# Altium schematic sheet Case2_Cosel.SchDoc
size A4
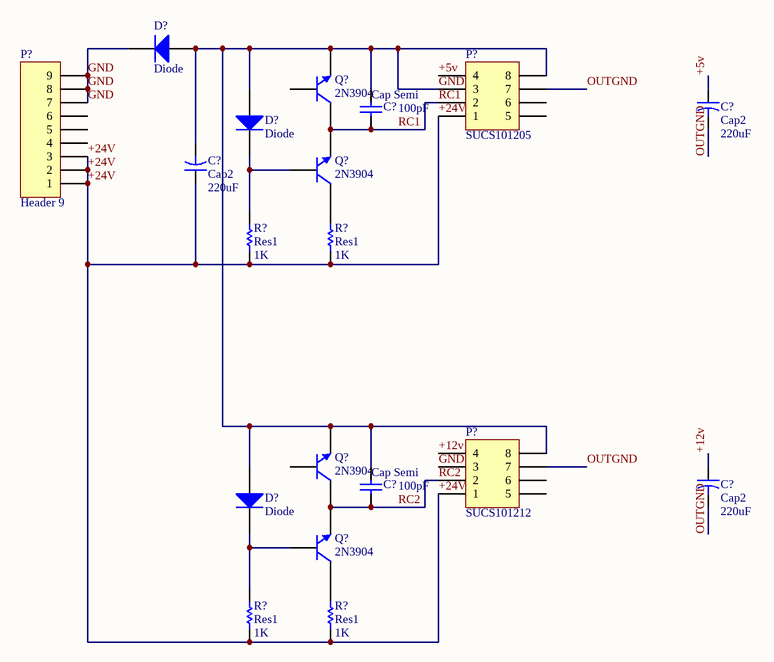
[diagram p0: Case2_Cosel.SchDoc]

## Parts
(Parts that share a designator on the sheet are numbered #1, #2 ... from top to bottom, then left to right.)
C?#1  Cap2  value 220uF  [CAPR5-4X5]
C?#2  Cap Semi  value 100pF  [C1206]
C?#3  Cap2  value 220uF  [CAPR5-4X5]
C?#4  Cap2  value 220uF  [CAPR5-4X5]
C?#5  Cap Semi  value 100pF  [C1206]
D?#1  Diode  [SMC]
D?#2  Diode  [SMC]
D?#3  Diode  [SMC]
P?#1  SUCS101205  [HDR2X4_CEN]
P?#2  Header 9  [HDR1X9]
P?#3  SUCS101212  [HDR2X4_CEN]
Q?#1  2N3904  [TO-92A]
Q?#2  2N3904  [TO-92A]
Q?#3  2N3904  [TO-92A]
Q?#4  2N3904  [TO-92A]
R?#1  Res1  value 1K  [AXIAL-0.3]
R?#2  Res1  value 1K  [AXIAL-0.3]
R?#3  Res1  value 1K  [AXIAL-0.3]
R?#4  Res1  value 1K  [AXIAL-0.3]

## Nets
+5v: C?#1.1 P?#1.4
+12v: C?#4.1 P?#3.4
+24V: C?#3.1 P?#1.1 P?#2.1 P?#2.2 P?#2.3 P?#3.1 R?#1.2 R?#2.1 R?#3.2 R?#4.1
GND: C?#2.2 C?#3.2 C?#5.2 D?#1.1(A) D?#1.2(K) D?#2.1(A) D?#3.1(A) P?#1.3 P?#1.8 P?#2.7 P?#2.8 P?#2.9 P?#3.3 P?#3.8 Q?#1.1(E) Q?#3.1(E)
OUTGND: C?#1.2 C?#4.2 P?#1.7 P?#3.7
RC1: C?#2.1 P?#1.2 Q?#1.3(C) Q?#2.1(E)
RC2: C?#5.1 P?#3.2 Q?#3.3(C) Q?#4.1(E)
NetD?#2_2: D?#2.2(K) Q?#2.2(B) R?#2.2
NetD?#3_2: D?#3.2(K) Q?#4.2(B) R?#4.2
NetQ?#2_3: Q?#2.3(C) R?#1.1
NetQ?#4_3: Q?#4.3(C) R?#3.1

Not connected (* = marked no-connect by the designer): P?#1 5 6; P?#2 4 5 6; P?#3 5 6; Q?#1 2(B); Q?#3 2(B)

## Library data of the parts
C?#1 C?#3 C?#4 = Cap2: Capacitor; Published: 23-Sep-2002; PackageReference: CAPR5-4X5; Publisher: Altium Limited
C?#2 C?#5 = Cap Semi: Capacitor (Semiconductor SIM Model); Published: 8-Jun-2000; LatestRevisionDate: 17-Jul-2002; LatestRevisionNote: Re-released for DXP Platform.; PackageReference: C1206; Publisher: Altium Limited
D?#1-D?#3 = Diode: Default Diode; Published: 8-Jun-2000; LatestRevisionDate: 17-Jul-2002; LatestRevisionNote: Re-released for DXP Platform.; PackageDocument: Sep-1996; PackageReference: SMC; Publisher: Altium Limited; Code_JEDEC: DO-214-AB
P?#1 P?#3 = Header 4X2A: Header, 4-Pin, Dual row; LatestRevisionDate: 17-Jul-2002; LatestRevisionNote: Re-released for DXP Platform.; Publisher: Altium Limited
P?#2 = Header 9: Header, 9-Pin; LatestRevisionDate: 17-Jul-2002; LatestRevisionNote: Re-released for DXP Platform.; Publisher: Altium Limited
Q?#1-Q?#4 = 2N3904: NPN General Purpose Amplifier; Published: 8-Jun-2000; LatestRevisionDate: 15-Jan-2003; LatestRevisionNote: PCB Footprint 'BCY-W3/D4.7' replaced; DatasheetDocument: 1997; PackageDocument: Sep-1998; PackageReference: TO-92A; Publisher: Altium Limited; Code_JEDEC: TO-92A; ComponentLink1Description: Manufacturer Link; ComponentLink1URL: http://www.fairchildsemi.com/; ComponentLink2Description: Datasheet; ComponentLink2URL: http://www.fairchildsemi.com/ds/2N%2F2N3904.pdf
R?#1-R?#4 = Res1: Resistor; Published: 8-Jun-2000; LatestRevisionDate: 17-Jul-2002; LatestRevisionNote: Re-released for DXP Platform.; PackageReference: AXIAL-0.3; Publisher: Altium Limited